# Altium schematic sheet boot.SchDoc
size A4
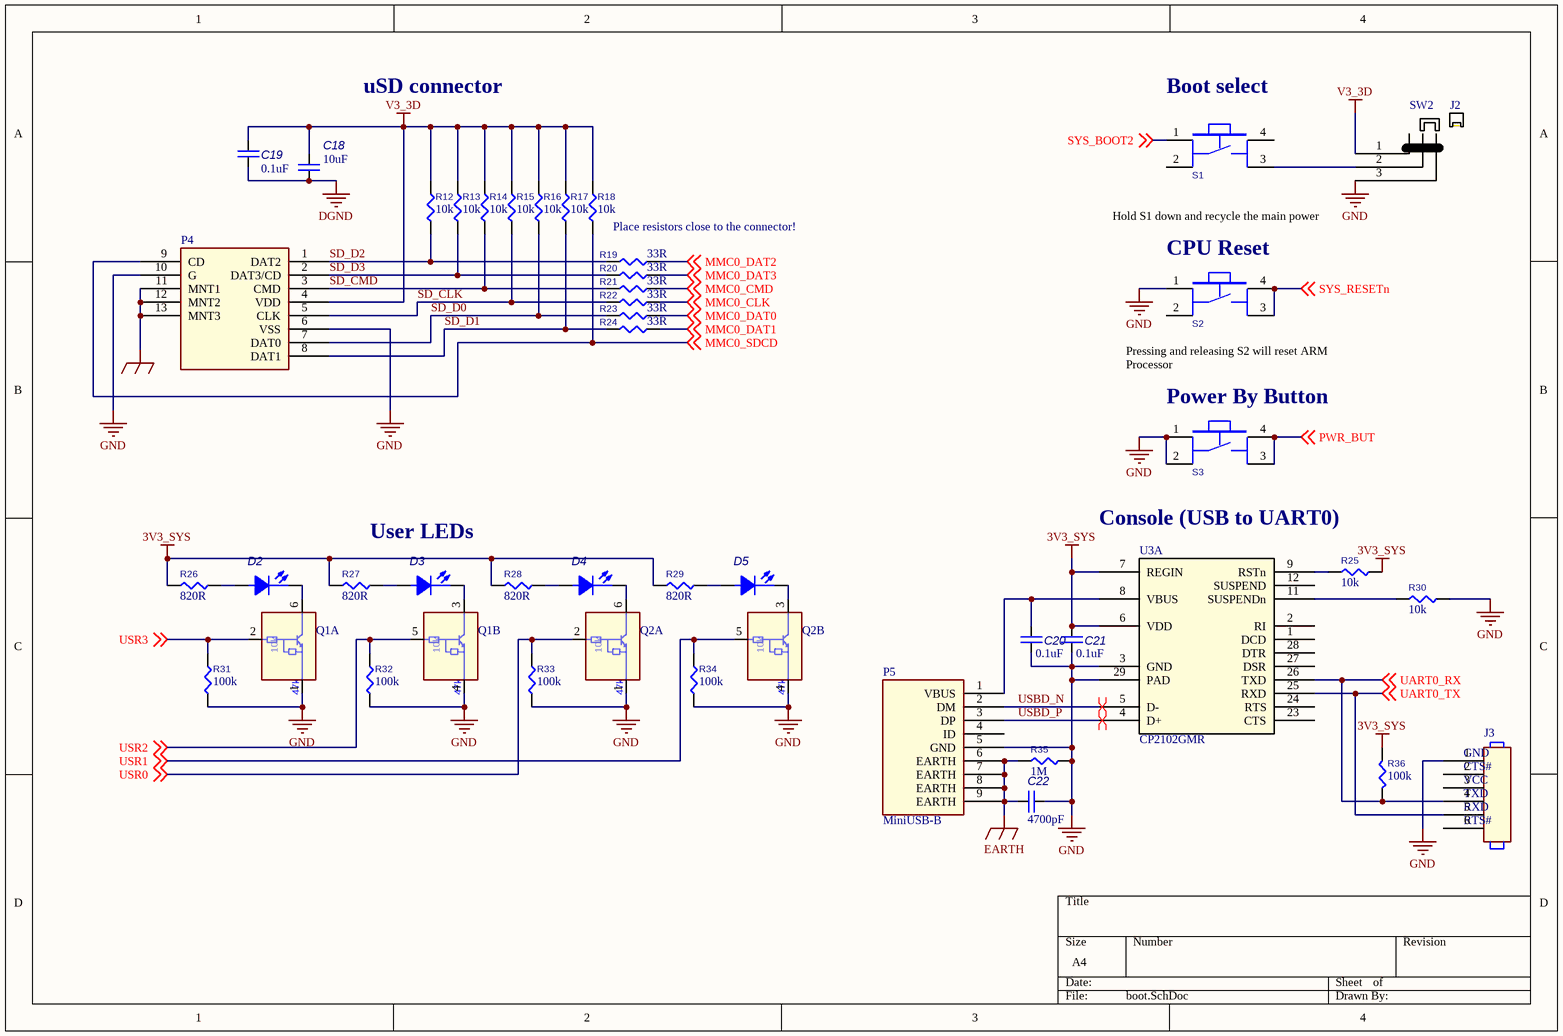
[diagram p0: boot.SchDoc]

## Parts
C18  value 10uF  [CC2012-0805]  (hidden comment: C0805)
C19  value 0.1uF  [CC1608-0603]  (hidden comment: C0603)
C20  value 0.1uF  [CC1608-0603]  (hidden comment: C0603)
C21  value 0.1uF  [CC1608-0603]  (hidden comment: C0603)
C22  value 4700pF  [CC1608-0603]  (hidden comment: C0603)
D2  LED0805  [LED0805]  (value not drawn)
D3  LED0805  [LED0805]  (value not drawn)
D4  LED0805  [LED0805]  (value not drawn)
D5  LED0805  [LED0805]  (value not drawn)
J2  Jumper-cap  (value not drawn)
J3  HEADER 6  [pls-6]  (value not drawn)
P4  (no value)  [TFC08WP01F-A-R1K-H]
P5  MiniUSB-B  [MINI-USB-B5 SMT]
Q1  RN1907  [SOT363-6L]  (value not drawn)  (parts A,B of 2)
Q2  RN1907  [SOT363-6L]  (value not drawn)  (parts A,B of 2)
R12  value 10k  [RESC1608X55N]  (hidden comment: R0603)
R13  value 10k  [RESC1608X55N]  (hidden comment: R0603)
R14  value 10k  [RESC1608X55N]  (hidden comment: R0603)
R15  value 10k  [RESC1608X55N]  (hidden comment: R0603)
R16  value 10k  [RESC1608X55N]  (hidden comment: R0603)
R17  value 10k  [RESC1608X55N]  (hidden comment: R0603)
R18  value 10k  [RESC1608X55N]  (hidden comment: R0603)
R19  value 33R  [RESC1608X55N]  (hidden comment: R0603)
R20  value 33R  [RESC1608X55N]  (hidden comment: R0603)
R21  value 33R  [RESC1608X55N]  (hidden comment: R0603)
R22  value 33R  [RESC1608X55N]  (hidden comment: R0603)
R23  value 33R  [RESC1608X55N]  (hidden comment: R0603)
R24  value 33R  [RESC1608X55N]  (hidden comment: R0603)
R25  value 10k  [RESC1608X55N]  (hidden comment: R0603)
R26  value 820R  [RESC1608X55N]  (hidden comment: R0603)
R27  value 820R  [RESC1608X55N]  (hidden comment: R0603)
R28  value 820R  [RESC1608X55N]  (hidden comment: R0603)
R29  value 820R  [RESC1608X55N]  (hidden comment: R0603)
R30  value 10k  [RESC1608X55N]  (hidden comment: R0603)
R31  value 100k  [RESC1608X55N]  (hidden comment: R0603)
R32  value 100k  [RESC1608X55N]  (hidden comment: R0603)
R33  value 100k  [RESC1608X55N]  (hidden comment: R0603)
R34  value 100k  [RESC1608X55N]  (hidden comment: R0603)
R35  value 1M  [RESC1608X55N]  (hidden comment: R0603)
R36  value 100k  [RESC1608X55N]  (hidden comment: R0603)
S1  *  [SWT-32]  (value not drawn)
S2  *  [SWT-32]  (value not drawn)
S3  *  [SWT-32]  (value not drawn)
SW2  Jumper-3p  [pls-3]  (value not drawn)
U3  CP2102GMR  [Qfn28-0.5]  (part A of 2)

## Nets
3V3_SYS: C21.1 R25.2 R26.2 R27.2 R28.2 R29.2 R36.2 U3.6(VDD) U3.7(REGIN)
DGND: C18.1 C19.2
EARTH: C22.1 P4.11(MNT1) P4.12(MNT2) P4.13(MNT3) P5.6(EARTH) P5.7(EARTH) P5.8(EARTH) P5.9(EARTH) R35.1
GND: C20.2 C21.2 C22.2 J3.1 P4.6(VSS) P4.10(G) P5.5(GND) Q1.1 Q1.4 Q2.1 Q2.4 R30.2 R31.1 R32.1 R33.1 R34.1 R35.2 S2.1 S3.1 S3.2 SW2.3 U3.3(GND) U3.29(PAD)
V3_3D: C18.2 C19.1 P4.4(VDD) R12.2 R13.2 R14.2 R15.2 R16.2 R17.2 R18.2 SW2.1
MMC0_CLK: R22.2 ; off-sheet MMC0_CLK
MMC0_CMD: R21.2 ; off-sheet MMC0_CMD
MMC0_DAT0: R23.2 ; off-sheet MMC0_DAT0
MMC0_DAT1: R24.2 ; off-sheet MMC0_DAT1
MMC0_DAT2: R19.2 ; off-sheet MMC0_DAT2
MMC0_DAT3: R20.2 ; off-sheet MMC0_DAT3
MMC0_SDCD: P4.9(CD) R18.1 ; off-sheet MMC0_SDCD
PWR_BUT: S3.3 S3.4 ; off-sheet PWR_BUT
SD_CLK: P4.5(CLK) R15.1 R22.1
SD_CMD: P4.3(CMD) R14.1 R21.1
SD_D0: P4.7(DAT0) R16.1 R23.1
SD_D1: P4.8(DAT1) R17.1 R24.1
SD_D2: P4.1(DAT2) R12.1 R19.1
SD_D3: P4.2(DAT3/CD) R13.1 R20.1
SYS_BOOT2: S1.1 ; off-sheet SYS_BOOT2
SYS_RESETn: S2.3 S2.4 ; off-sheet SYS_RESETn
UART0_RX: J3.4 R36.1 U3.26(TXD) ; off-sheet UART0_RX
UART0_TX: J3.5 U3.25(RXD) ; off-sheet UART0_TX
USBD_N: P5.2(DM) U3.5(D-)
USBD_P: P5.3(DP) U3.4(D+)
USR0: Q2.2 R33.2 ; off-sheet USR0
USR1: Q2.5 R34.2 ; off-sheet USR1
USR2: Q1.5 R32.2 ; off-sheet USR2
USR3: Q1.2 R31.2 ; off-sheet USR3
NetC20_1: C20.1 P5.1(VBUS) U3.8(VBUS)
NetD2_A: D2.A R26.1
NetD2_K: D2.K(C) Q1.6
NetD3_A: D3.A R27.1
NetD3_K: D3.K(C) Q1.3
NetD4_A: D4.A R28.1
NetD4_K: D4.K(C) Q2.6
NetD5_A: D5.A R29.1
NetD5_K: D5.K(C) Q2.3
NetR25_1: R25.1 U3.9(RSTn)
NetR30_1: R30.1 U3.11(SUSPENDn)
NetS1_3: S1.3 SW2.2

Not connected (* = marked no-connect by the designer): J3 2 3 6; P5 4(ID); S1 2 4; S2 2; U3 1(DCD) 2(RI) 12(SUSPEND) 23(CTS) 24(RTS) 27(DSR) 28(DTR)

## Layout directives
differential pair: USBD_N, USBD_P

## Notes on the sheet
- uSD connector
- (near S1) Boot select
- Place resistors close to the connector!
- Hold S1 down and recycle the main power
- (near S2) CPU Reset
- (near S2) Pressing and releasing S2 will reset ARM Processor
- (near S3) Power By Button
- User LEDs
- Console (USB to UART0)
- (near J3) GND
- (near J3) CTS#
- (near J3) VCC
- (near J3) TXD
- (near J3) RXD
- (near J3) RTS#
- (in symbol RN1907, part A) 10k; 47k
- (in symbol RN1907, part B) 10k; 47k

## Library data of the parts
D2-D5 = LED0805: LED 0805; Value: *
J2 = Jumper-cap: Jumper; P/N: MJ-0
J3 = HEADER 6: CONN HEADER 6POS, VERTICAL,  .100 STR TIN; Mfr: FCI; P/N: 68000-406HLF
P4 = TFC08WP01F-R1K-H-CN: Connector for microSD™ Card (Push-push Type); Mfr: AUK Contractors Co, LTD; P/N: TFC08WP01F-R1K-H-CN
P5 = MiniUSB-B: Mini USB Type B CONNECTOR; Mfr: Hirose; P/N: UX60SC-MB-5ST(80)
Q1 Q2 = RN1907: Transistor Silicon NPN; Mfr: ONS; P/N: MUN5211DW1T1G
S1-S3 = SWT-32: Push button; Vendor: brownbear.ru; P/N: SWT-32
SW2 = Jumper-3p: PLS-3 2.54mm pin connector; P/N: PLS-3
U3 = CP2102GMR: USB UART convertor; P/N: CP2102-GMR
C18 = C0805: P/N: *
C19-C22 = C0603: P/N: *
R12-R36 = R0603: P/N: *